# Altium schematic sheet STM32F103_开关量输入.SchDoc
size A4; SheetNumber: 3; SheetTotal: 5
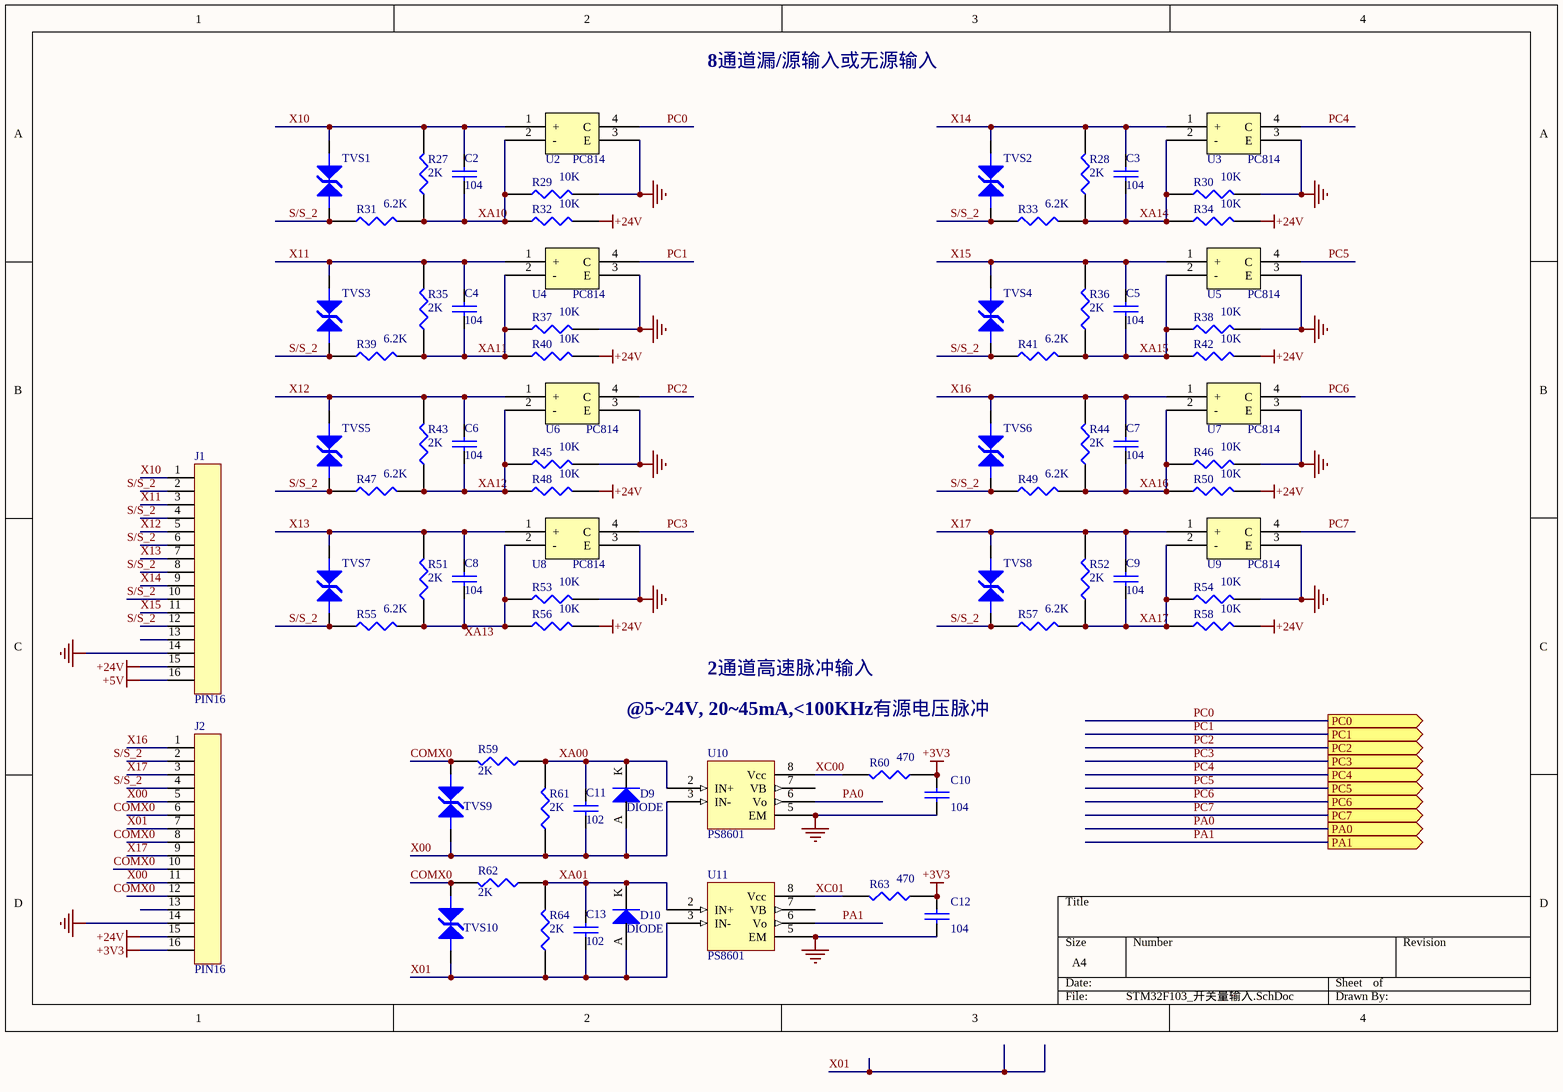
[diagram p0: STM32F103_开关量输入.SchDoc]

## Parts
C2  104  [0603]
C3  104  [0603]
C4  104  [0603]
C5  104  [0603]
C6  104  [0603]
C7  104  [0603]
C8  104  [0603]
C9  104  [0603]
C10  104  [0603]
C11  102  [0603]
C12  104  [0603]
C13  102  [0603]
D9  DIODE  [LED_0805]
D10  DIODE  [LED_0805]
J1  PIN16  [KF128-5.08-16P]
J2  PIN16  [KF128-5.08-16P]
R27  2K  [0603]
R28  2K  [0603]
R29  10K  [0603]
R30  10K  [0603]
R31  6.2K  [0603]
R32  10K  [0603]
R33  6.2K  [0603]
R34  10K  [0603]
R35  2K  [0603]
R36  2K  [0603]
R37  10K  [0603]
R38  10K  [0603]
R39  6.2K  [0603]
R40  10K  [0603]
R41  6.2K  [0603]
R42  10K  [0603]
R43  2K  [0603]
R44  2K  [0603]
R45  10K  [0603]
R46  10K  [0603]
R47  6.2K  [0603]
R48  10K  [0603]
R49  6.2K  [0603]
R50  10K  [0603]
R51  2K  [0603]
R52  2K  [0603]
R53  10K  [0603]
R54  10K  [0603]
R55  6.2K  [0603]
R56  10K  [0603]
R57  6.2K  [0603]
R58  10K  [0603]
R59  2K  [0603]
R60  470  [0603]
R61  2K  [0603]
R62  2K  [0603]
R63  470  [0603]
R64  2K  [0603]
TVS1  (no value)  [TVS]
TVS2  (no value)  [TVS]
TVS3  (no value)  [TVS]
TVS4  (no value)  [TVS]
TVS5  (no value)  [TVS]
TVS6  (no value)  [TVS]
TVS7  (no value)  [TVS]
TVS8  (no value)  [TVS]
TVS9  (no value)  [TVS]
TVS10  (no value)  [TVS]
U2  PC814  [SOP4_PC817]
U3  PC814  [SOP4_PC817]
U4  PC814  [SOP4_PC817]
U5  PC814  [SOP4_PC817]
U6  PC814  [SOP4_PC817]
U7  PC814  [SOP4_PC817]
U8  PC814  [SOP4_PC817]
U9  PC814  [SOP4_PC817]
U10  PS8601  [DIP8_8601]
U11  PS8601  [DIP8_8601]

## Ports
PA0 (out), PA1 (out), PC0 (out), PC1 (out), PC2 (out), PC3 (out), PC4 (out), PC5 (out), PC6 (out), PC7 (out)

## Nets
+3V3: C10.1 C12.1 J2.16 R60.1 R63.1
+5V: J1.16
+24V: J1.15 J2.15 R32.2 R34.2 R40.2 R42.2 R48.2 R50.2 R56.2 R58.2
GND: C10.2 C12.2 J1.14 J2.14 R29.2 R30.2 R37.2 R38.2 R45.2 R46.2 R53.2 R54.2 U2.3(E) U3.3(E) U4.3(E) U5.3(E) U6.3(E) U7.3(E) U8.3(E) U9.3(E) U10.5(EM) U11.5(EM)
NC: U10.1(NC) U10.4(NC) U11.1(NC) U11.4(NC)
COMX0: J2.10 R59.2 R62.2 TVS9.2(K) TVS10.2(K)
PA0: U10.6(Vo) ; port PA0
PA1: U11.6(Vo) ; port PA1
PC0: U2.4(C) ; port PC0
PC1: U4.4(C) ; port PC1
PC2: U6.4(C) ; port PC2
PC3: U8.4(C) ; port PC3
PC4: U3.4(C) ; port PC4
PC5: U5.4(C) ; port PC5
PC6: U7.4(C) ; port PC6
PC7: U9.4(C) ; port PC7
S/S_2: J1.10 R31.1 R33.1 R39.1 R41.1 R47.1 R49.1 R55.1 R57.1 TVS1.1(A) TVS2.1(A) TVS3.1(A) TVS4.1(A) TVS5.1(A) TVS6.1(A) TVS7.1(A) TVS8.1(A)
X00: C11.2 D9.A J2.5 J2.11 R61.1 TVS9.1(A) U10.3(IN-)
X01: C13.2 D10.A J2.7 R64.1 TVS10.1(A) U11.3(IN-)
X10: C2.1 J1.1 R27.2 TVS1.2(K) U2.1(+)
X11: C4.1 J1.3 R35.2 TVS3.2(K) U4.1(+)
X12: C6.1 J1.5 R43.2 TVS5.2(K) U6.1(+)
X13: C8.1 J1.7 R51.2 TVS7.2(K) U8.1(+)
X14: C3.1 J1.9 R28.2 TVS2.2(K) U3.1(+)
X15: C5.1 J1.11 R36.2 TVS4.2(K) U5.1(+)
X16: C7.1 J2.1 R44.2 TVS6.2(K) U7.1(+)
X17: C9.1 J2.3 J2.9 R52.2 TVS8.2(K) U9.1(+)
XA00: C11.1 D9.K R59.1 R61.2 U10.2(IN+)
XA01: C13.1 D10.K R62.1 R64.2 U11.2(IN+)
XA10: C2.2 R27.1 R29.1 R31.2 R32.1 U2.2(-)
XA11: C4.2 R35.1 R37.1 R39.2 R40.1 U4.2(-)
XA12: C6.2 R43.1 R45.1 R47.2 R48.1 U6.2(-)
XA14: C3.2 R28.1 R30.1 R33.2 R34.1 U3.2(-)
XA15: C5.2 R36.1 R38.1 R41.2 R42.1 U5.2(-)
XA16: C7.2 R44.1 R46.1 R49.2 R50.1 U7.2(-)
XA17: C9.2 R52.1 R54.1 R57.2 R58.1 U9.2(-)
XC00: R60.2 U10.8(Vcc)
XC01: R63.2 U11.8(Vcc)
NetC8_2: C8.2 R51.1 R53.1 R55.2 R56.1 U8.2(-)

Not connected (* = marked no-connect by the designer): J1 2 4 6 8 12 13; J2 2 4 6 8 12 13; U10 7(VB); U11 7(VB)

## Notes on the sheet
- 8通道漏/源输入或无源输入
- @5~24V, 20~45mA,<100KHz有源电压脉冲
- 2通道高速脉冲输入
- Labels drawn without touching a wire or pin: COMX0, S/S_2, XA13

## Library data of the parts
C2-C13 = CAP: Capacitor
R27-R64 = RES1
TVS1-TVS10 = TVS
U2-U9 = PC817
U10 U11 = PS8601: High speed optocoupler